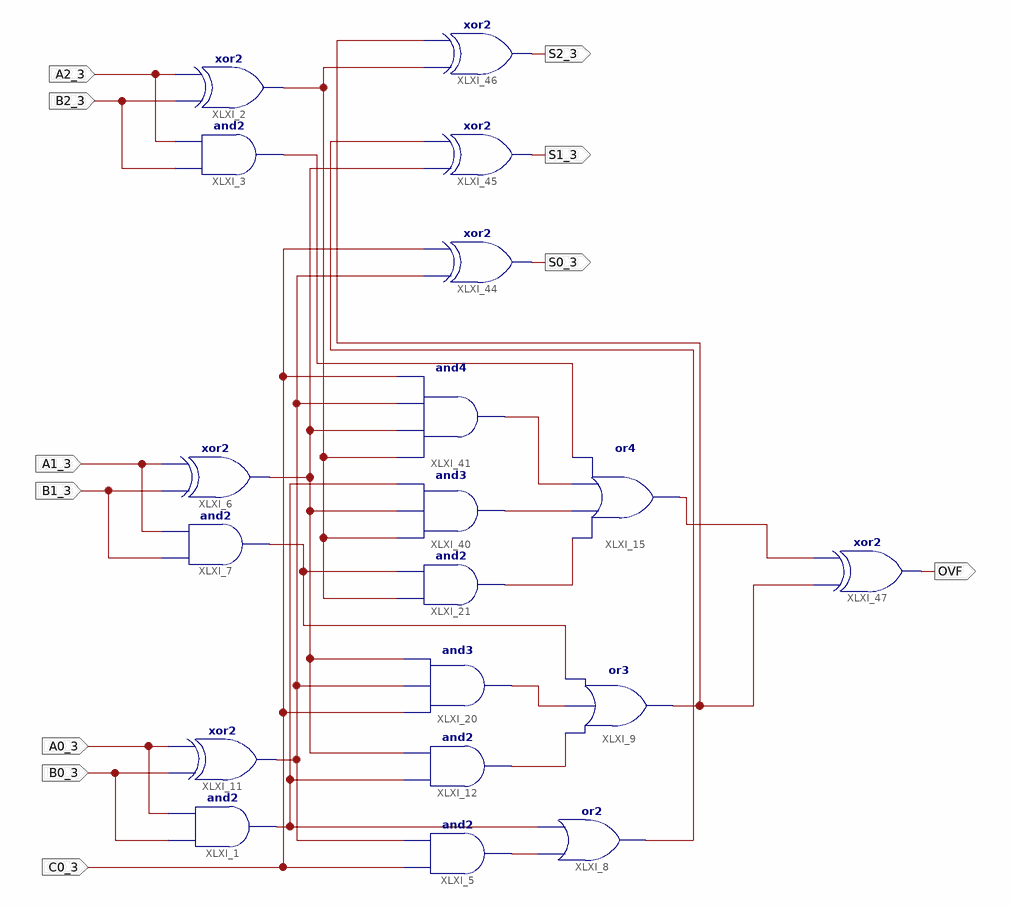
[diagram p0: schematic sheet 1]
// Xilinx ISE schematic LastCLAAdder.sch (spartan3e) as structural Verilog: 19 symbols, 11 ports
module LastCLAAdder (
  input  B2_3,
  input  A2_3,
  input  B0_3,
  input  A0_3,
  input  B1_3,
  input  A1_3,
  input  C0_3,
  output S0_3,
  output S1_3,
  output S2_3,
  output OVF
);

  wire C1_3, C2_3, C3_3, G0_3, G1_3, G2_3, P0_3, P1_3, P2_3, XLXN_5, XLXN_42, XLXN_43, XLXN_48, XLXN_49,
       XLXN_50;

  xor XLXI_2 (P2_3, B2_3, A2_3);
  and XLXI_3 (G2_3, B2_3, A2_3);
  and XLXI_1 (G0_3, B0_3, A0_3);
  and XLXI_5 (XLXN_5, C0_3, P0_3);
  xor XLXI_6 (P1_3, B1_3, A1_3);
  and XLXI_7 (G1_3, B1_3, A1_3);
  or XLXI_8 (C1_3, XLXN_5, G0_3);
  or XLXI_9 (C2_3, XLXN_42, XLXN_43, G1_3);
  and XLXI_41 (XLXN_50, P2_3, P1_3, P0_3, C0_3);
  xor XLXI_11 (P0_3, B0_3, A0_3);
  and XLXI_12 (XLXN_42, G0_3, P1_3);
  and XLXI_20 (XLXN_43, C0_3, P0_3, P1_3);
  and XLXI_40 (XLXN_49, P2_3, P1_3, G0_3);
  or XLXI_15 (C3_3, XLXN_48, XLXN_49, XLXN_50, G2_3);
  and XLXI_21 (XLXN_48, P2_3, G1_3);
  xor XLXI_44 (S0_3, P0_3, C0_3);
  xor XLXI_45 (S1_3, P1_3, C1_3);
  xor XLXI_46 (S2_3, P2_3, C2_3);
  xor XLXI_47 (OVF, C2_3, C3_3);
endmodule
